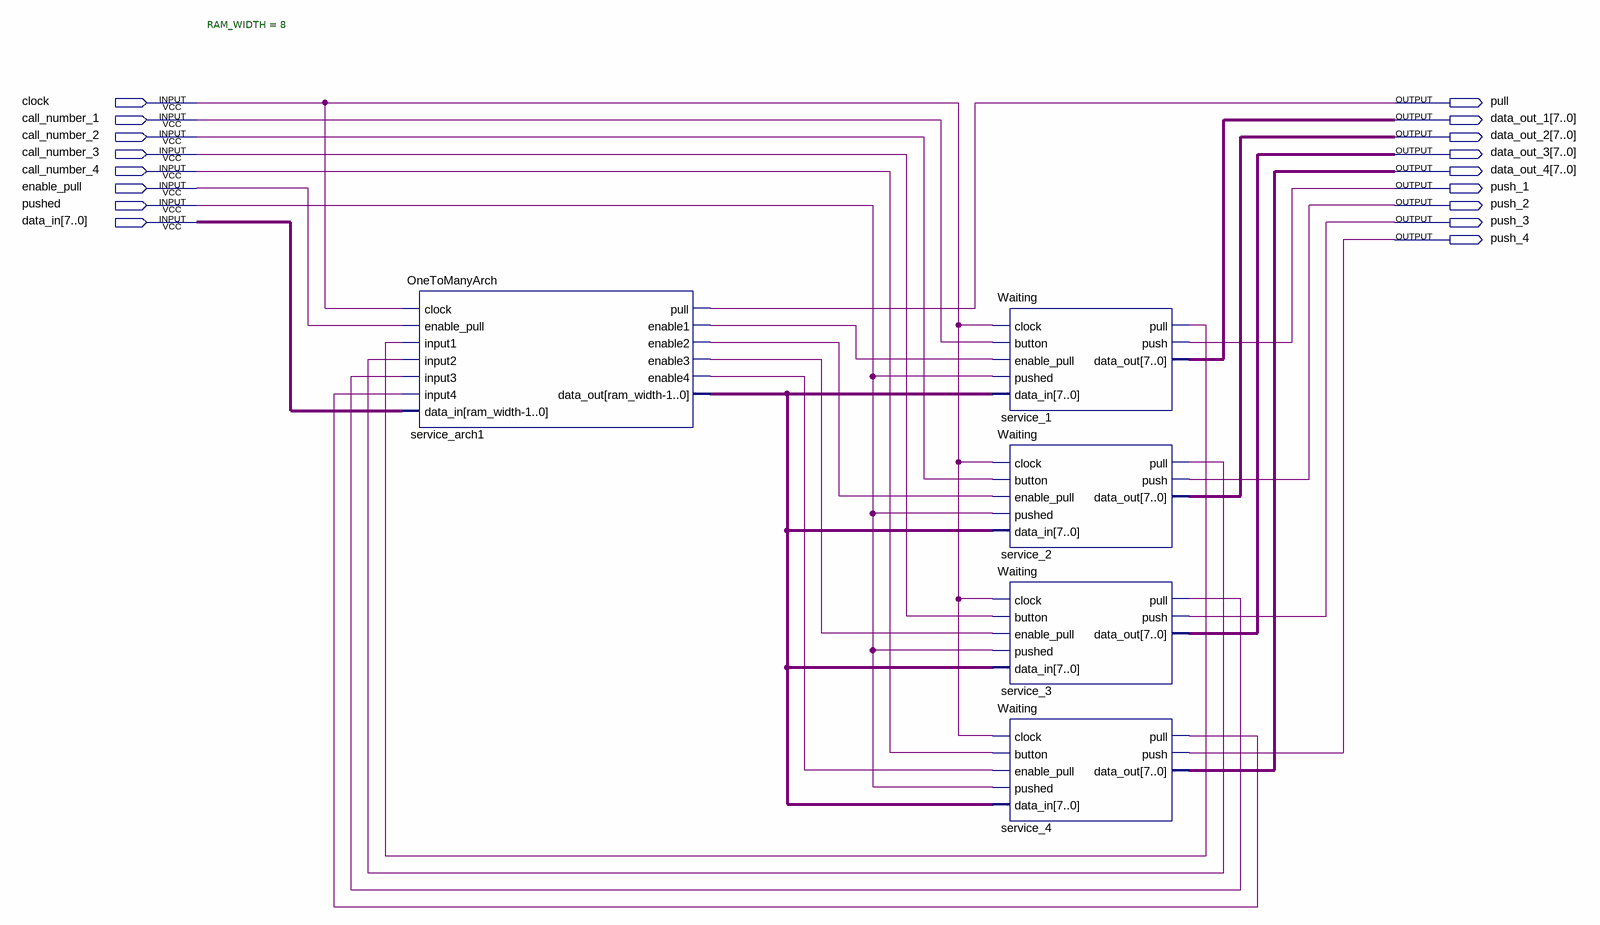
[diagram p0: schematic sheet]
// Quartus schematic Services.bdf as structural Verilog: 5 symbols, 17 pins
module Services (
  input  clock,
  input  call_number_1,
  input  call_number_2,
  input  call_number_3,
  input  call_number_4,
  input  enable_pull,
  input  pushed,
  input  [7:0] data_in,
  output pull,
  output [7:0] data_out_1,
  output [7:0] data_out_2,
  output [7:0] data_out_3,
  output [7:0] data_out_4,
  output push_1,
  output push_2,
  output push_3,
  output push_4
);

  wire service_1_pull, service_2_pull, service_3_pull, service_4_pull, service_arch1_enable1,
       service_arch1_enable2, service_arch1_enable3, service_arch1_enable4;
  wire [7:0] service_arch1_data_out;

  OneToManyArch #(.RAM_WIDTH(8)) service_arch1 (
    .clock(clock), .enable_pull(enable_pull), .input1(service_1_pull), .input2(service_2_pull),
    .input3(service_3_pull), .input4(service_4_pull), .data_in(data_in), .pull(pull),
    .enable1(service_arch1_enable1), .enable2(service_arch1_enable2), .enable3(service_arch1_enable3),
    .enable4(service_arch1_enable4), .data_out(service_arch1_data_out));
  Waiting service_1 (
    .clock(clock), .button(call_number_1), .enable_pull(service_arch1_enable1), .pushed(pushed),
    .data_in(service_arch1_data_out), .pull(service_1_pull), .push(push_1), .data_out(data_out_1));
  Waiting service_2 (
    .clock(clock), .button(call_number_2), .enable_pull(service_arch1_enable2), .pushed(pushed),
    .data_in(service_arch1_data_out), .pull(service_2_pull), .push(push_2), .data_out(data_out_2));
  Waiting service_3 (
    .clock(clock), .button(call_number_3), .enable_pull(service_arch1_enable3), .pushed(pushed),
    .data_in(service_arch1_data_out), .pull(service_3_pull), .push(push_3), .data_out(data_out_3));
  Waiting service_4 (
    .clock(clock), .button(call_number_4), .enable_pull(service_arch1_enable4), .pushed(pushed),
    .data_in(service_arch1_data_out), .pull(service_4_pull), .push(push_4), .data_out(data_out_4));
endmodule
